# Altium schematic sheet MCU.SchDoc
size A4; Revision: B.1(PCB.SCH)
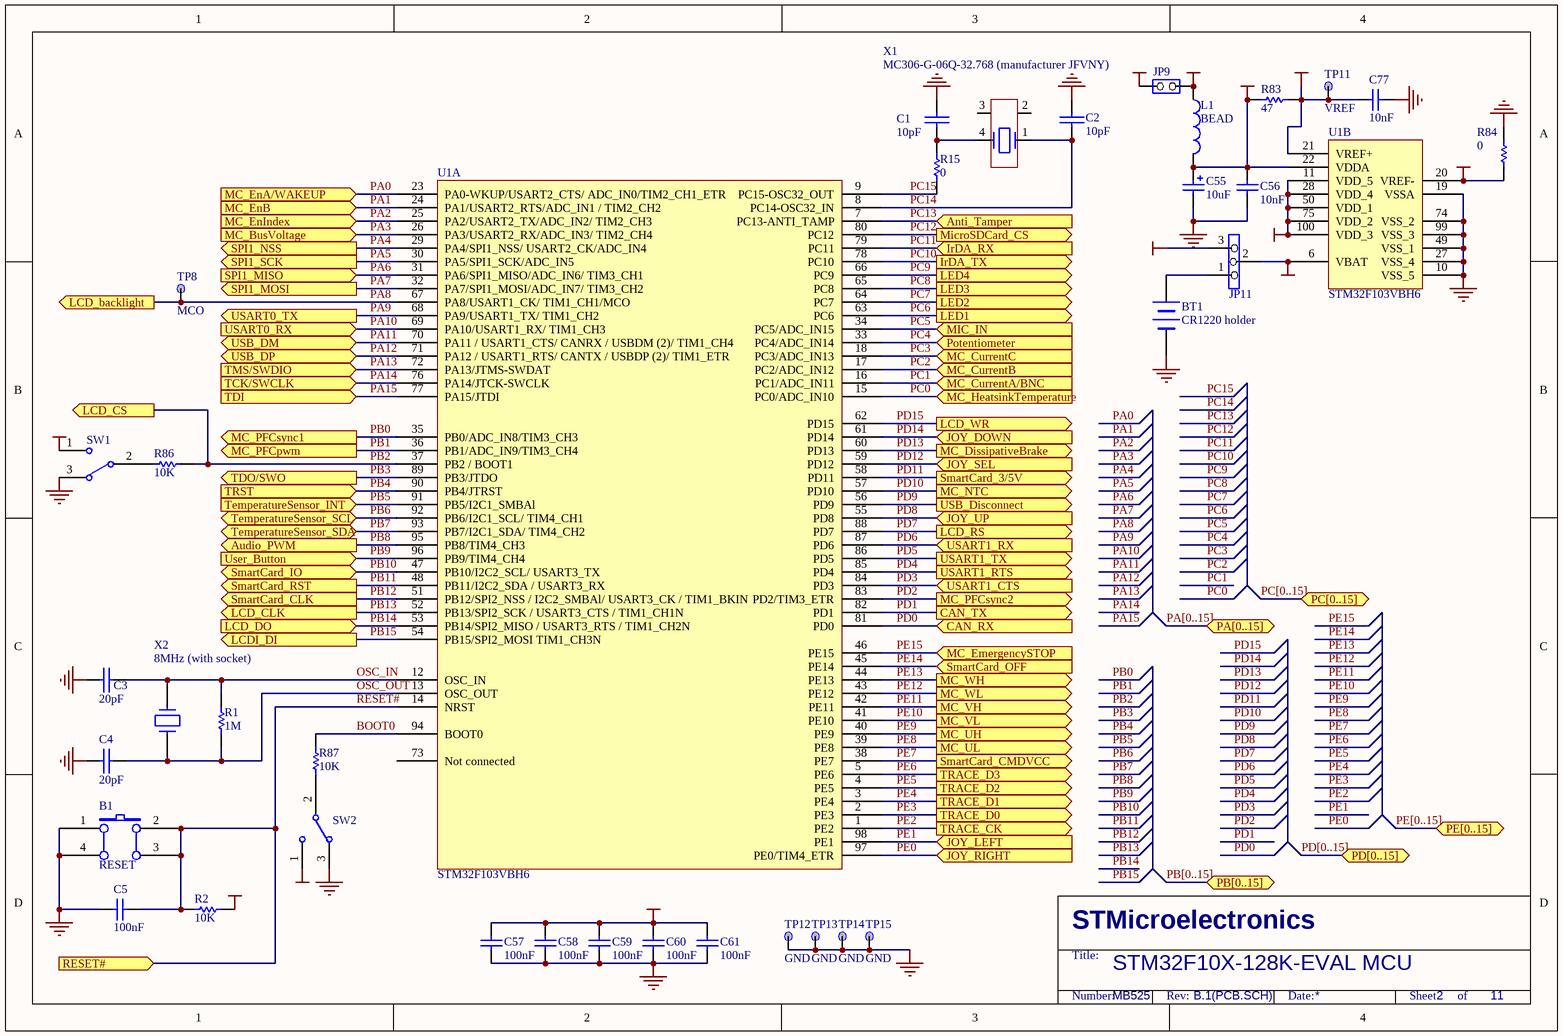
[diagram p0: MCU.SchDoc]

## Parts
B1  RESET  [PB10]
BT1  CR1220 holder  [BATT]
C1  10pF  [0603]
C2  10pF  [0603]
C3  20pF  [0603]
C4  20pF  [0603]
C5  100nF  [0603P]
C55  10uF  [TAN-B]
C56  10nF  [0603]
C57  100nF  [0603P]
C58  100nF  [0603P]
C59  100nF  [0603P]
C60  100nF  [0603P]
C61  100nF  [0603P]
C77  10nF  [0603]
JP9  (no value)  [SIP2]
JP11  (no value)  [SIP3]
L1  BEAD  [0603]
R1  1M  [0603]
R2  10K  [0603]
R15  0  [0805]
R83  47  [0805]
R84  0  [0805]
R86  10K  [0603]
R87  10K  [0603]
SW1  (no value)  [SIP3]
SW2  (no value)  [SIP3]
TP8  MCO  [TP]
TP11  VREF  [TP]
TP12  GND  [TP]
TP13  GND  [TP]
TP14  GND  [TP]
TP15  GND  [TP]
U1  STM32F103VBH6  (parts A,B of 2)
X1  MC306-G-06Q-32.768 (manufacturer JFVNY)  [SM8]
X2  8MHz (with socket)  [XTAL1]

## Ports
Anti_Tamper (in), Audio_PWM (out), CAN_RX (in), CAN_TX (out), IrDA_RX (in), IrDA_TX (out), JOY_DOWN (in), JOY_LEFT (in), JOY_RIGHT (in), JOY_SEL (in), JOY_UP (in), LCD_backlight (out), LCD_CLK (out), LCD_CS (out), LCD_DO (in), LCD_RS (out), LCD_WR (out), LCDI_DI (out), LED1 (out), LED2 (out), LED3 (out), LED4 (out), MC_BusVoltage (in), MC_CurrentA/BNC (in), MC_CurrentB (in), MC_CurrentC (in), MC_DissipativeBrake (out), MC_EmergencySTOP (in), MC_EnA/WAKEUP (in), MC_EnB (in), MC_EnIndex (in), MC_HeatsinkTemperature (in), MC_NTC (out), MC_PFCpwm (out), MC_PFCsync1 (out), MC_PFCsync2 (out), MC_UH (out), MC_UL (out), MC_VH (out), MC_VL (out), MC_WH (out), MC_WL (out), MIC_IN (in), MicroSDCard_CS (out), PA[0..15] (bidir), PB[0..15] (bidir), PC[0..15] (bidir), PD[0..15] (bidir), PE[0..15] (bidir), Potentiometer (in), RESET# (in), SmartCard_3/5V (out), SmartCard_CLK (out), SmartCard_CMDVCC (out), SmartCard_IO (bidir), SmartCard_OFF (in), SmartCard_RST (out), SPI1_MISO (in), SPI1_MOSI (out), SPI1_NSS (out), SPI1_SCK (out), TCK/SWCLK (in), TDI (in), TDO/SWO (out), TemperatureSensor_INT (in), TemperatureSensor_SCL (bidir), TemperatureSensor_SDA (bidir), TMS/SWDIO (in), TRACE_CK (out), TRACE_D0 (out), TRACE_D1 (out), TRACE_D2 (out), TRACE_D3 (out), TRST (in), USART0_RX (in), USART0_TX (out), USART1_CTS (in), USART1_RTS (out), USART1_RX (in), USART1_TX (out), USB_Disconnect (out), USB_DM (bidir), USB_DP (bidir), User_Button (in)

## Nets
+3V3: JP9.1(COMMON) JP11.3 R2.2 SW1.1 SW2.1
GND: B1.1(A0) B1.4(A1) BT1.2(-) C1.2 C2.2 C3.2 C4.2 C5.1 C55.2 C56.2 C57.2 C58.2 C59.2 C60.2 C61.2 C77.2 R84.1 SW1.3 SW2.3 TP12.1 TP13.1 TP14.1 TP15.1 U1.10(VSS_5) U1.19(VSSA) U1.27(VSS_4) U1.49(VSS_1) U1.74(VSS_2) U1.99(VSS_3)
Vbat: JP11.2 U1.6(VBAT)
VDD: C57.1 C58.1 C59.1 C60.1 C61.1 JP9.2(NO) L1.1 U1.11(VDD_5) U1.28(VDD_4) U1.50(VDD_1) U1.75(VDD_2) U1.100(VDD_3)
VDDA: C55.1 C56.1 L1.2 R83.2 U1.22(VDDA)
VREF+: C77.1 R83.1 TP11.1 U1.21(VREF+)
VREF-: R84.2 U1.20(VREF-)
BOOT0: R87.1 U1.94(BOOT0)
OSC_IN: C3.1 R1.2 U1.12(OSC_IN) X2.2
OSC_OUT: C4.1 R1.1 U1.13(OSC_OUT) X2.1
PA0: U1.23(PA0-WKUP/USART2_CTS/
ADC_IN0/TIM2_CH1_ETR) ; port MC_EnA/WAKEUP
PA1: U1.24(PA1/USART2_RTS/ADC_IN1
/
TIM2_CH2) ; port MC_EnB
PA2: U1.25(PA2/USART2_TX/ADC_IN2/
TIM2_CH3) ; port MC_EnIndex
PA3: U1.26(PA3/USART2_RX/ADC_IN3/
TIM2_CH4) ; port MC_BusVoltage
PA4: U1.29(PA4/SPI1_NSS/
USART2_CK/ADC_IN4) ; port SPI1_NSS
PA5: U1.30(PA5/SPI1_SCK/ADC_IN5) ; port SPI1_SCK
PA6: U1.31(PA6/SPI1_MISO/ADC_IN6/
TIM3_CH1) ; port SPI1_MISO
PA7: U1.32(PA7/SPI1_MOSI/ADC_IN7/
TIM3_CH2) ; port SPI1_MOSI
PA8: TP8.1 U1.67(PA8/USART1_CK/
TIM1_CH1/MCO) ; port LCD_backlight
PA9: U1.68(PA9/USART1_TX/
TIM1_CH2) ; port USART0_TX
PA10: U1.69(PA10/USART1_RX/
TIM1_CH3) ; port USART0_RX
PA11: U1.70(PA11_/_USART1_CTS/
CANRX_/_USBDM_(2)/
TIM1_CH4) ; port USB_DM
PA12: U1.71(PA12_/_USART1_RTS/
CANTX_/_USBDP_(2)/
TIM1_ETR) ; port USB_DP
PA13: U1.72(PA13/JTMS-SWDAT) ; port TMS/SWDIO
PA14: U1.76(PA14/JTCK-SWCLK) ; port TCK/SWCLK
PA15: U1.77(PA15/JTDI) ; port TDI
PB0: U1.35(PB0/ADC_IN8/TIM3_CH3) ; port MC_PFCsync1
PB1: U1.36(PB1/ADC_IN9/TIM3_CH4) ; port MC_PFCpwm
PB2: R86.1 U1.37(PB2_/_BOOT1) ; port LCD_CS
PB3: U1.89(PB3/JTDO) ; port TDO/SWO
PB4: U1.90(PB4/JTRST) ; port TRST
PB5: U1.91(PB5/I2C1_SMBAl) ; port TemperatureSensor_INT
PB6: U1.92(PB6/I2C1_SCL/
TIM4_CH1) ; port TemperatureSensor_SCL
PB7: U1.93(PB7/I2C1_SDA/
TIM4_CH2) ; port TemperatureSensor_SDA
PB8: U1.95(PB8/TIM4_CH3) ; port Audio_PWM
PB9: U1.96(PB9/TIM4_CH4) ; port User_Button
PB10: U1.47(PB10/I2C2_SCL/
USART3_TX) ; port SmartCard_IO
PB11: U1.48(PB11/I2C2_SDA_/
USART3_RX) ; port SmartCard_RST
PB12: U1.51(PB12/SPI2_NSS_/
I2C2_SMBAl/
USART3_CK_/
TIM1_BKIN) ; port SmartCard_CLK
PB13: U1.52(PB13/SPI2_SCK_/
USART3_CTS_/
TIM1_CH1N) ; port LCD_CLK
PB14: U1.53(PB14/SPI2_MISO_/
USART3_RTS_/
TIM1_CH2N) ; port LCD_DO
PB15: U1.54(PB15/SPI2_MOSI
TIM1_CH3N) ; port LCDI_DI
PC0: U1.15(PC0/ADC_IN10) ; port MC_HeatsinkTemperature
PC1: U1.16(PC1/ADC_IN11) ; port MC_CurrentA/BNC
PC2: U1.17(PC2/ADC_IN12) ; port MC_CurrentB
PC3: U1.18(PC3/ADC_IN13) ; port MC_CurrentC
PC4: U1.33(PC4/ADC_IN14) ; port Potentiometer
PC5: U1.34(PC5/ADC_IN15) ; port MIC_IN
PC6: U1.63(PC6) ; port LED1
PC7: U1.64(PC7) ; port LED2
PC8: U1.65(PC8) ; port LED3
PC9: U1.66(PC9) ; port LED4
PC10: U1.78(PC10) ; port IrDA_TX
PC11: U1.79(PC11) ; port IrDA_RX
PC12: U1.80(PC12) ; port MicroSDCard_CS
PC13: U1.7(PC13-ANTI_TAMP) ; port Anti_Tamper
PC14: C2.1 U1.8(PC14-OSC32_IN) X1.1
PC15: R15.2 U1.9(PC15-OSC32_OUT)
PD0: U1.81(PD0) ; port CAN_RX
PD1: U1.82(PD1) ; port CAN_TX
PD2: U1.83(PD2/TIM3_ETR) ; port MC_PFCsync2
PD3: U1.84(PD3) ; port USART1_CTS
PD4: U1.85(PD4) ; port USART1_RTS
PD5: U1.86(PD5) ; port USART1_TX
PD6: U1.87(PD6) ; port USART1_RX
PD7: U1.88(PD7) ; port LCD_RS
PD8: U1.55(PD8) ; port JOY_UP
PD9: U1.56(PD9) ; port USB_Disconnect
PD10: U1.57(PD10) ; port MC_NTC
PD11: U1.58(PD11) ; port SmartCard_3/5V
PD12: U1.59(PD12) ; port JOY_SEL
PD13: U1.60(PD13) ; port MC_DissipativeBrake
PD14: U1.61(PD14) ; port JOY_DOWN
PD15: U1.62(PD15) ; port LCD_WR
PE0: U1.97(PE0/TIM4_ETR) ; port JOY_RIGHT
PE1: U1.98(PE1) ; port JOY_LEFT
PE2: U1.1(PE2) ; port TRACE_CK
PE3: U1.2(PE3) ; port TRACE_D0
PE4: U1.3(PE4) ; port TRACE_D1
PE5: U1.4(PE5) ; port TRACE_D2
PE6: U1.5(PE6) ; port TRACE_D3
PE7: U1.38(PE7) ; port SmartCard_CMDVCC
PE8: U1.39(PE8) ; port MC_UL
PE9: U1.40(PE9) ; port MC_UH
PE10: U1.41(PE10) ; port MC_VL
PE11: U1.42(PE11) ; port MC_VH
PE12: U1.43(PE12) ; port MC_WL
PE13: U1.44(PE13) ; port MC_WH
PE14: U1.45(PE14) ; port SmartCard_OFF
PE15: U1.46(PE15) ; port MC_EmergencySTOP
RESET#: B1.2(B0) B1.3(B1) C5.2 R2.1 U1.14(NRST) ; port RESET#
NetBT1_1: BT1.1(+) JP11.1
NetC1_1: C1.1 R15.1 X1.4
NetR86_2: R86.2 SW1.2
NetR87_2: R87.2 SW2.2

Not connected (* = marked no-connect by the designer): U1 73(Not_connected); X1 2 3

## Buses and harness runs
bus PA[0..15] = port PA[0..15]
bus PB[0..15] = port PB[0..15]
bus PC[0..15] = port PC[0..15]
bus PD[0..15] = port PD[0..15]
bus PE[0..15] = port PE[0..15]

## Notes on the sheet
- STM32F10X-128K-EVAL MCU
- MB525
- 2
- 11
- STMicroelectronics
- Title:
- Number:
- Rev:
- Date:
- Sheet       of

## Library data of the parts
B1 = SW PUSHBUTTON: SE PUSHBUTTON
BT1 = BATTERY
C1-C4 C57-C61 = CAP: Capacitor
  C57-C61: Published: 8-Jun-2000; Revision: July-2002: Re-released for DXP Platform.; Publisher: Altium Limited; Value: 100nF
C5 = CAP: Capacitor; Value: 100pF; Published: 8-Jun-2000; Revision: July-2002: Re-released for DXP Platform.; Publisher: Altium Limited
C55 = Cap Pol1: Polarized Capacitor (Radial); Published: 8-Jun-2000; Revision: July-2002: Re-released for DXP Platform.; Publisher: Altium Limited; Value: 10uF
C56 C77 = Cap: Capacitor; Published: 8-Jun-2000; Revision: July-2002: Re-released for DXP Platform.; Publisher: Altium Limited; Value: 10nF
JP9 = JP2
JP11 = Jumper3
L1 = Inductor: Value: 100uH; Published: 8-Jun-2000; Revision: July-2002: Re-released for DXP Platform.; Publisher: Altium Limited
R1 R15 R83 R84 = Res1: Resistor; Value: 1K; Published: 8-Jun-2000; Revision: July-2002: Re-released for DXP Platform.; Publisher: Altium Limited
R2 R86 R87 = res1: Resistor; Value: 1K; Published: 8-Jun-2000; Revision: July-2002: Re-released for DXP Platform.; Publisher: Altium Limited
SW1 SW2 = SW-SPDT: SPDT Subminiature Toggle Switch, Right Angle Mounting, Vertical Actuation; Revision 1: Jul-2002: Re-released for DXP Platform.; Revision 2: 17-Dec-2003: Schematic revised, PCB Footprint replaced.; Published: 24-Mar-1999; Datasheet: Latest Revision: 05-Dec-2000; Publisher: Altium Limited
TP8 TP11-TP15 = TP
X1 = MC306
X2 = CRYSTAL